# Altium project МПСУ.464414.22-01.PrjPcb
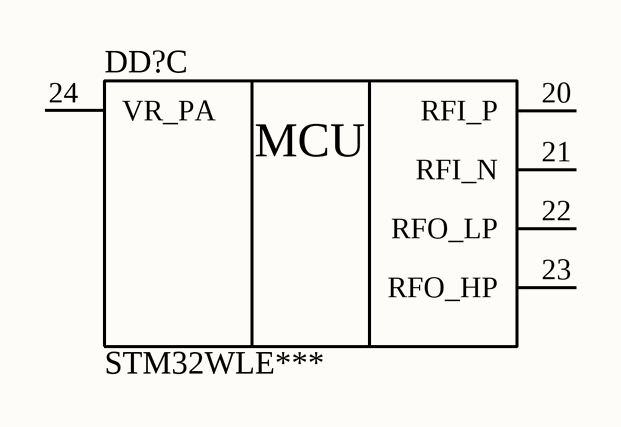
[diagram p0: МПСУ.464414.22-01 RF.SchDoc]
3 sheets, 5 parts. Net scope: global (net labels, ports and power ports of the same name join across sheets).
Sheets:
  МПСУ.464414.22-01 RF.SchDoc
  МПСУ.464414.22-01 MCU.SchDoc
  МПСУ.464414.22-01 Power.SchDoc

## Sheet МПСУ.464414.22-01 RF.SchDoc
size 420 x 297 mm; Address1: Address1; Address2: Address2; Address3: Address3; Address4: Address4; SheetNumber: 1; SheetTotal: 3; DocumentTypeSCH: Э3

### Parts
(Parts that share a designator on the sheet are numbered #1, #2 ... from top to bottom, then left to right.)
DD?#1  DD?  [QFN50P700X700X90_HS-49N]  (value not drawn)  (part C of 5)

### Nets

Not connected (* = marked no-connect by the designer): DD?#1 20(RFI_P) 21(RFI_N) 22(RFO_LP) 23(RFO_HP) 24(VR_PA)

### Notes on the sheet
- Подп. и дата
- Инв. № дубл.
- Взам. инв. №
- Инв. № подл.
- Изм.
- Лист
- № докум.
- Подп.
- Дата
- Копировал
- Формат А3

### Library data of the parts
DD?#1 = STM32WLE***: Multiprotocol LPWAN 32-bit Arm® Cortex®-M4 MCUs, LoRa®, (G)FSK, (G)MSK, BPSK, up to 256KB Flash, 64KB SRAM; Manufacturer: ST Electronics; Designer: Лазба; 3D_Body: +; ComponentLink1Description: Техническое описание; ComponentLink1URL: Q:\Libs\Descriptions_PDF\DS13105.pdf; Category: IC; Subcategory: MCU; Status: Check; PartNumber: STM32WLE***

## Sheet МПСУ.464414.22-01 MCU.SchDoc
size 420 x 297 mm; Address1: Address1; Address2: Address2; Address3: Address3; Address4: Address4; SheetNumber: 2; SheetTotal: 3; DocumentTypeSCH: Э3
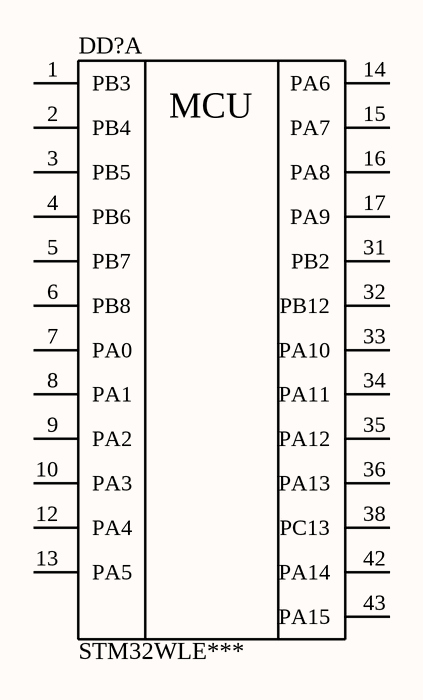
[diagram p1: МПСУ.464414.22-01 MCU.SchDoc]

### Parts
(Parts that share a designator on the sheet are numbered #1, #2 ... from top to bottom, then left to right.)
DD?#2  DD?  [QFN50P700X700X90_HS-49N]  (value not drawn)  (part A of 5)

### Nets

Not connected (* = marked no-connect by the designer): DD?#2 1(PB3) 2(PB4) 3(PB5) 4(PB6) 5(PB7) 6(PB8) 7(PA0) 8(PA1) 9(PA2) 10(PA3) 12(PA4) 13(PA5) 14(PA6) 15(PA7) 16(PA8) 17(PA9) 31(PB2) 32(PB12) 33(PA10) 34(PA11) 35(PA12) 36(PA13) 38(PC13) 42(PA14) 43(PA15)

### Notes on the sheet
- Подп. и дата
- Инв. № дубл.
- Взам. инв. №
- Инв. № подл.
- Изм.
- Лист
- № докум.
- Подп.
- Дата
- Копировал
- Формат А3

### Library data of the parts
DD?#2 = STM32WLE***: as DD?#1 on sheet МПСУ.464414.22-01 RF; ComponentLink1Description: Техническое описание; ComponentLink1URL: Q:\Libs\Descriptions_PDF\DS13105.pdf; Category: IC; Subcategory: MCU; Status: Check; PartNumber: STM32WLE***

## Sheet МПСУ.464414.22-01 Power.SchDoc
size 420 x 297 mm; Address1: Address1; Address2: Address2; Address3: Address3; Address4: Address4; SheetNumber: 3; SheetTotal: 3; DocumentTypeSCH: Э3
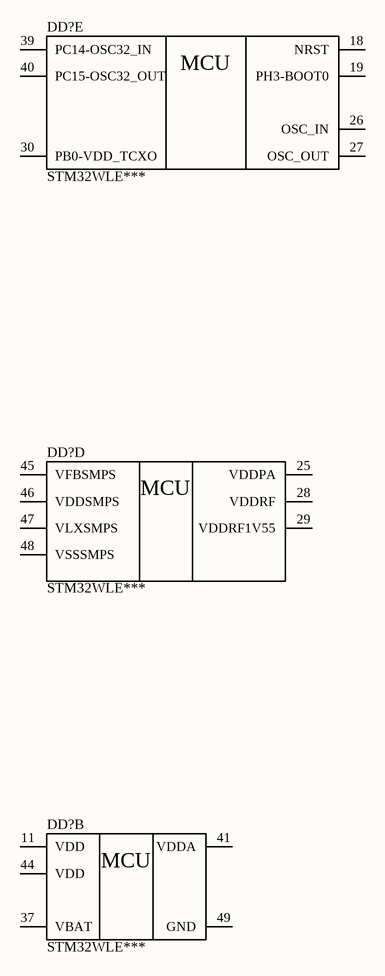
[diagram p2: МПСУ.464414.22-01 Power.SchDoc]

### Parts
(Parts that share a designator on the sheet are numbered #1, #2 ... from top to bottom, then left to right.)
DD?#3  DD?  [QFN50P700X700X90_HS-49N]  (value not drawn)  (part E of 5)
DD?#4  DD?  [QFN50P700X700X90_HS-49N]  (value not drawn)  (part D of 5)
DD?#5  DD?  [QFN50P700X700X90_HS-49N]  (value not drawn)  (part B of 5)

### Nets

Not connected (* = marked no-connect by the designer): DD?#3 18(NRST) 19(PH3-BOOT0) 26(OSC_IN) 27(OSC_OUT) 30(PB0-VDD_TCXO) 39(PC14-OSC32_IN) 40(PC15-OSC32_OUT); DD?#4 25(VDDPA) 28(VDDRF) 29(VDDRF1V55) 45(VFBSMPS) 46(VDDSMPS) 47(VLXSMPS) 48(VSSSMPS); DD?#5 11(VDD) 37(VBAT) 41(VDDA) 44(VDD) 49(GND)

### Notes on the sheet
- Подп. и дата
- Инв. № дубл.
- Взам. инв. №
- Инв. № подл.
- Изм.
- Лист
- № докум.
- Подп.
- Дата
- Копировал
- Формат А3

### Library data of the parts
DD?#3-DD?#5 = STM32WLE***: as DD?#1 on sheet МПСУ.464414.22-01 RF; ComponentLink1Description: Техническое описание; ComponentLink1URL: Q:\Libs\Descriptions_PDF\DS13105.pdf; Category: IC; Subcategory: MCU; Status: Check; PartNumber: STM32WLE***